# EasyEDA schematic USB-Hub.json
TITLE: Sheet_1; REV: 1.0; Date: 2024-08-21; Sheet: 1/1; Drawn By: mudali25; Company: Your Company
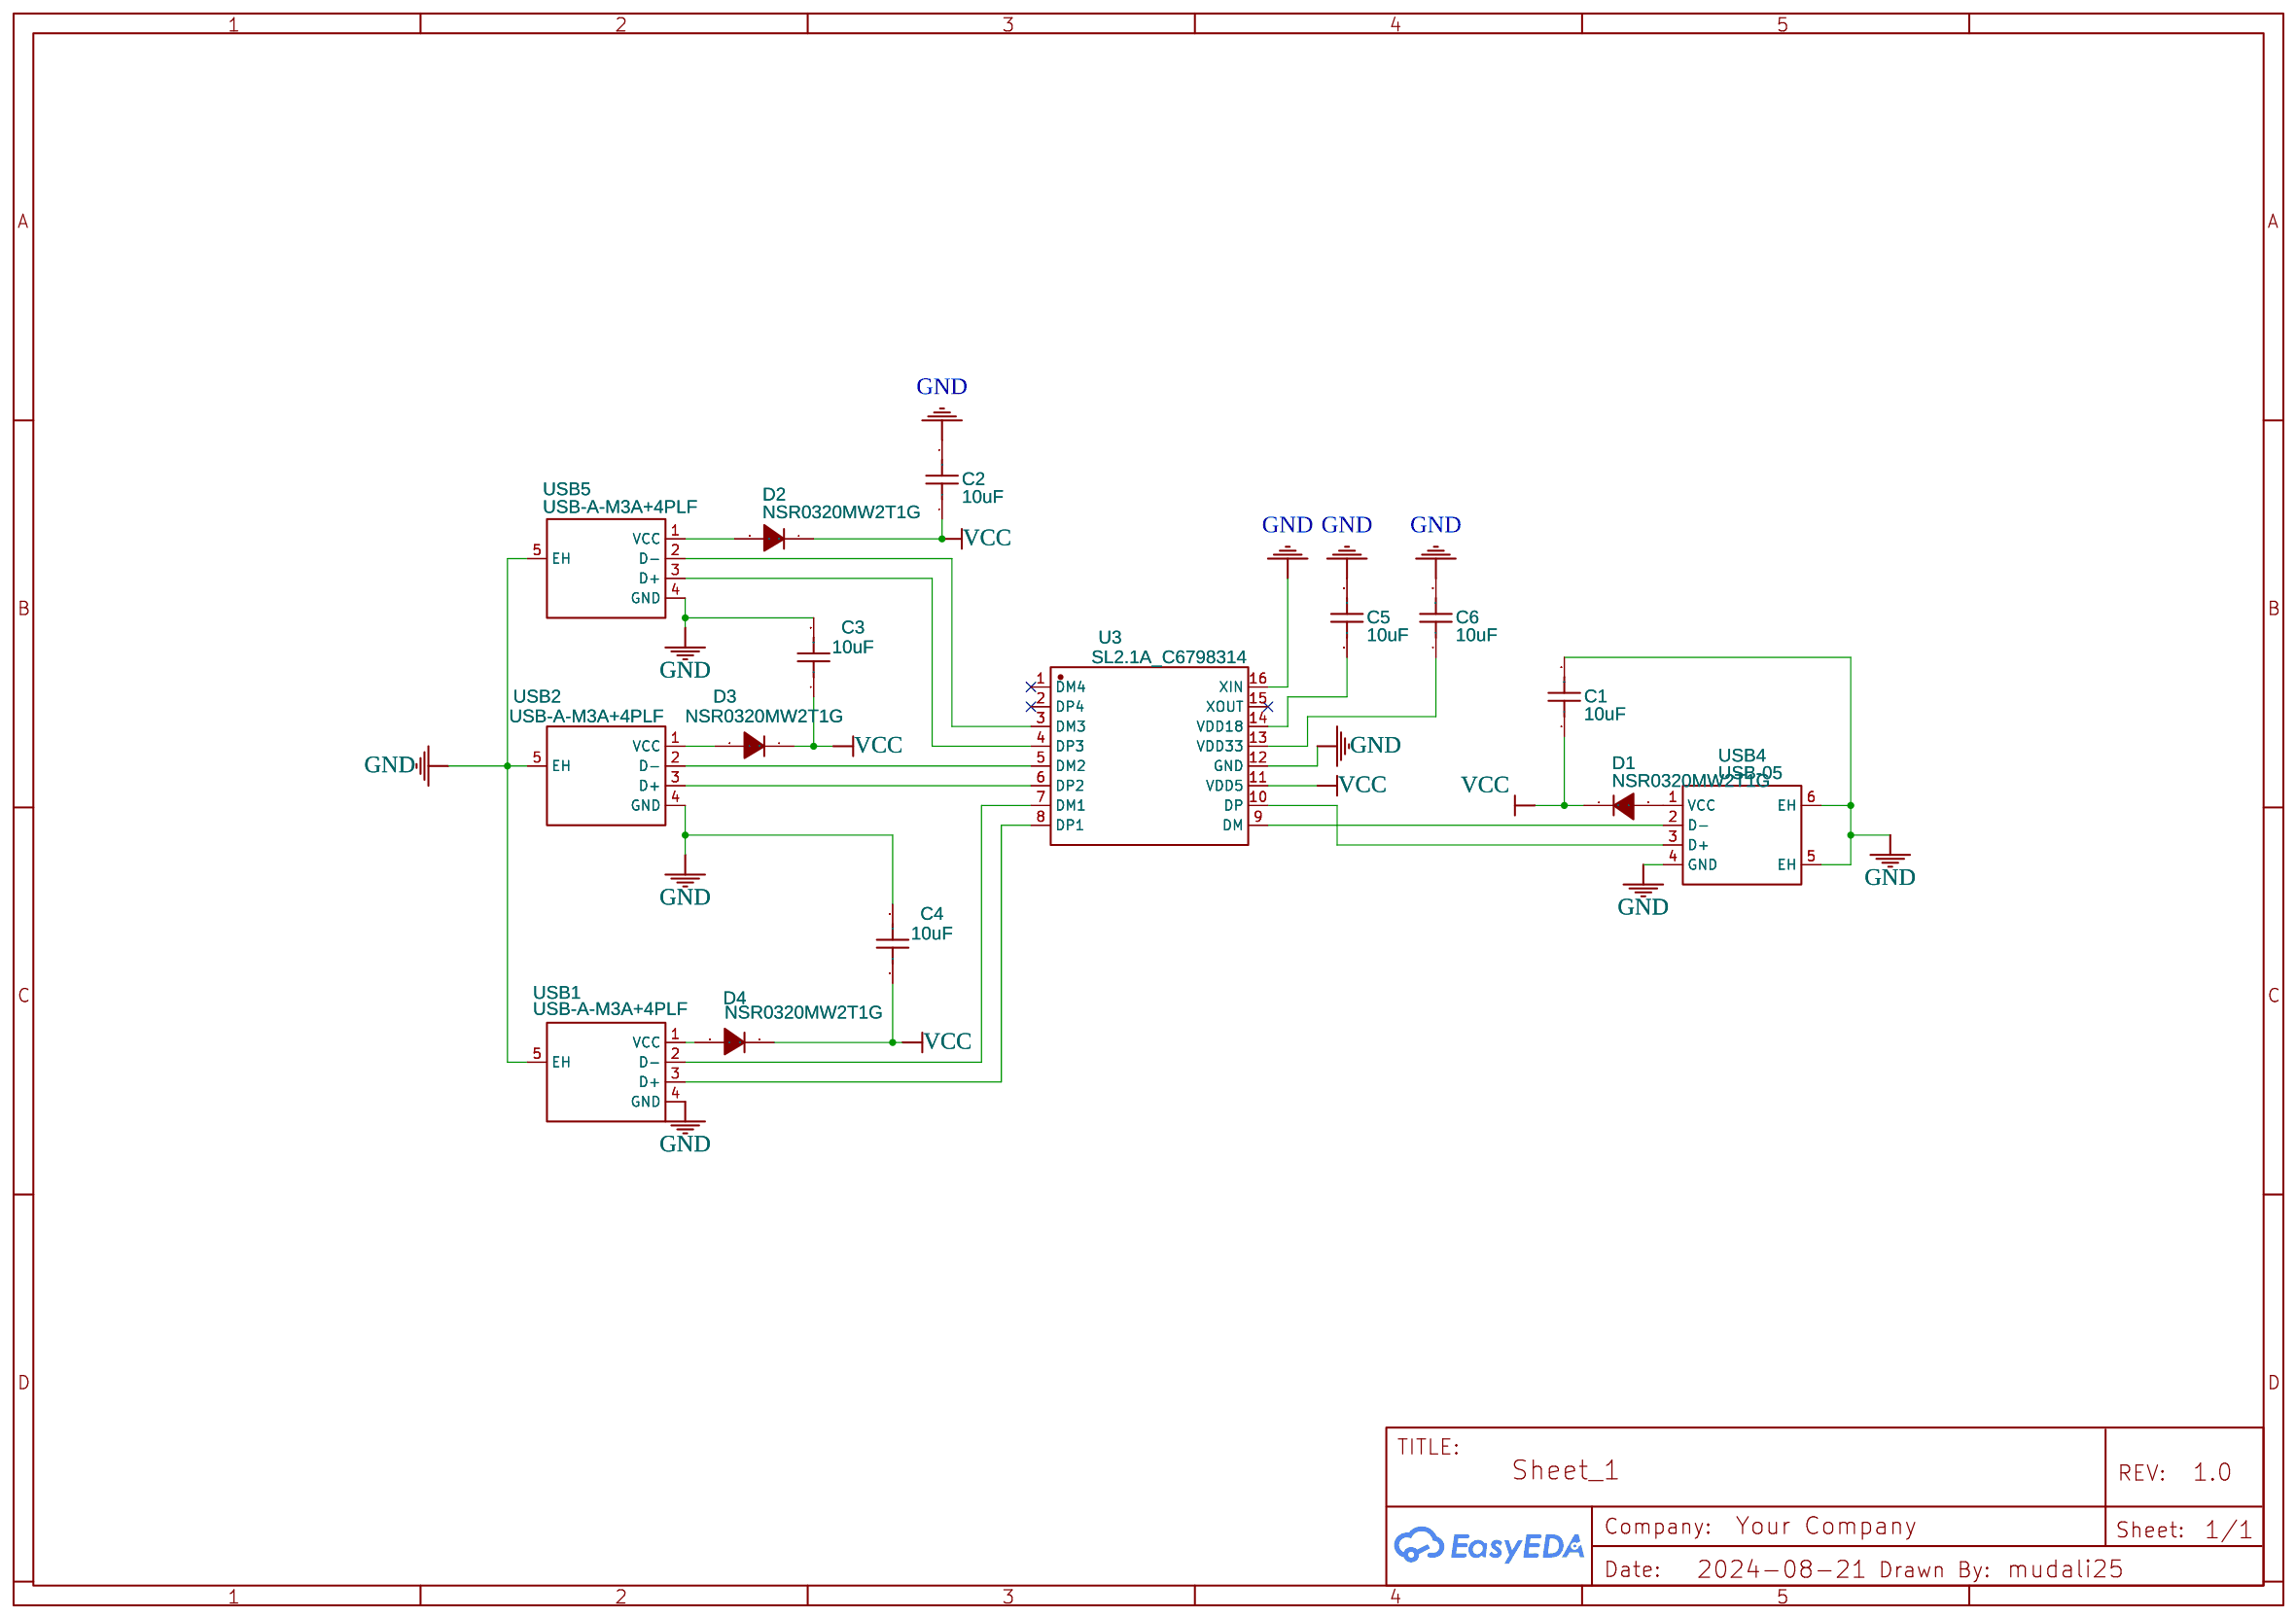
[diagram p0: schematic sheet]

## Parts
C1  10uF  [C0603]
C2  10uF  [C0603]
C3  10uF  [C0603]
C4  10uF  [C0603]
C5  10uF  [C0603]
C6  10uF  [C0603]
D1  NSR0320MW2T1G  [SOD-323_L1.8-W1.3-LS2.5-RD]
D2  NSR0320MW2T1G  [SOD-323_L1.8-W1.3-LS2.5-RD]
D3  NSR0320MW2T1G  [SOD-323_L1.8-W1.3-LS2.5-RD]
D4  NSR0320MW2T1G  [SOD-323_L1.8-W1.3-LS2.5-RD]
U3  SL2.1A_C6798314  [SOP-16_L10.0-W3.9-P1.27-LS6.0-BL]
USB1  USB-A-M3A+4PLF  [USB-A-TH_USB-A-M3A-4PLF]
USB2  USB-A-M3A+4PLF  [USB-A-TH_USB-A-M3A-4PLF]
USB4  USB-05  [USB-A-TH_USB-05]
USB5  USB-A-M3A+4PLF  [USB-A-TH_USB-A-M3A-4PLF]

## Library data of the parts
C1-C6 = CL10A106KP8NNNC: Supplier: LCSC; Manufacturer: SAMSUNG(三星); Supplier Part: C19702; JLCPCB Part Class: Basic Part
D1-D4 = NSR0320MW2T1G: Supplier: LCSC; Manufacturer: onsemi(安森美); Supplier Part: C48192; JLCPCB Part Class: Extended Part
U3 = SL2.1A_C6798314: Contributor: lcsc; Supplier: LCSC; Supplier Part: C6798314; Manufacturer: CoreChips(和芯润德); Manufacturer Part: SL2.1A; JLCPCB Part Class: Extended Part
USB1 USB2 USB5 = USB-A-M3A+4PLF: Contributor: LCSC; Supplier: LCSC; Supplier Part: C718032; Manufacturer: JINJIA(金佳); JLCPCB Part Class: Extended Part
USB4 = USB-05: Contributor: LCSC; Supplier: LCSC; Manufacturer: SOFNG(硕方); Supplier Part: C112454; JLCPCB Part Class: Extended Part

## Nets
GND: C1.2 C2.2 C3.2 C4.2 C5.2 C6.2 U3.12(GND) U3.16(XIN) USB1.4(GND) USB1.5(EH) USB2.4(GND) USB2.5(EH) USB4.4(GND) USB4.5(EH) USB4.6(EH) USB5.4(GND) USB5.5(EH)
VCC: C1.1 C2.1 C3.1 C4.1 D1.1(C) D2.1(C) D3.1(C) D4.1(C) U3.11(VDD5)
Net-(C5-1): C5.1 U3.14(VDD18)
Net-(C6-1): C6.1 U3.13(VDD33)
Net-(D1-2): D1.2(A) USB4.1(VCC)
Net-(D2-2): D2.2(A) USB5.1(VCC)
Net-(D3-2): D3.2(A) USB2.1(VCC)
Net-(D4-2): D4.2(A) USB1.1(VCC)
Net-(U3-3): U3.3(DM3) USB5.2(D-)
Net-(U3-4): U3.4(DP3) USB5.3(D+)
Net-(U3-5): U3.5(DM2) USB2.2(D-)
Net-(U3-6): U3.6(DP2) USB2.3(D+)
Net-(U3-7): U3.7(DM1) USB1.2(D-)
Net-(U3-8): U3.8(DP1) USB1.3(D+)
Net-(U3-9): U3.9(DM) USB4.2(D-)
Net-(U3-10): U3.10(DP) USB4.3(D+)

Not connected (* = marked no-connect by the designer): U3 1(DM4)* 2(DP4)* 15(XOUT)*
